# EAGLE design Seri_Board_Led_v1.1 (EAGLE 9.6.2)
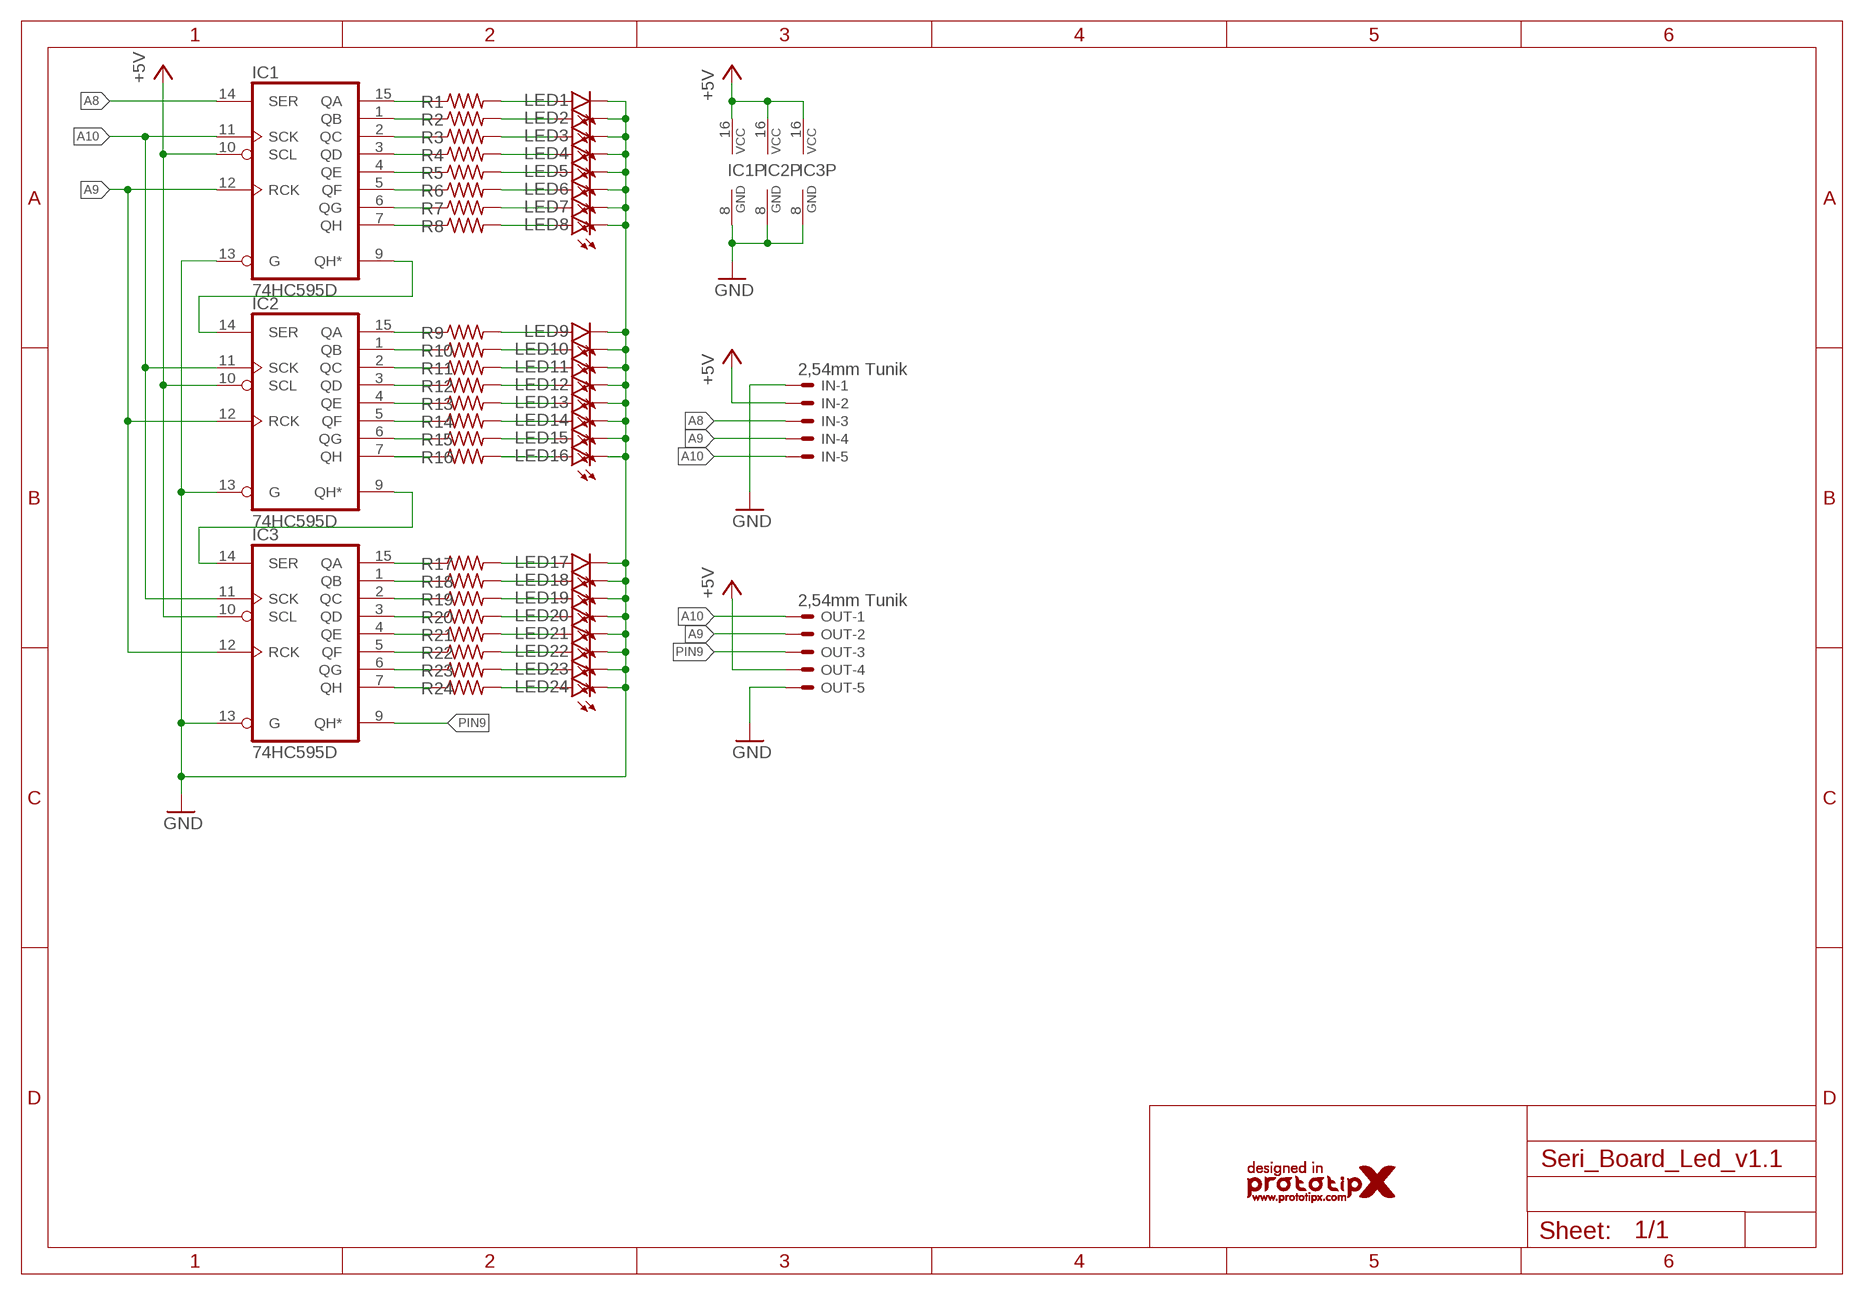
[diagram p0: schematic, sheet 1]

## Parts
IC1  74HC595D  [SO16]
IC2  74HC595D  [SO16]
IC3  74HC595D  [SO16]
IN  2,54mm Tunik  C-GRID-05-70543  [70543-05]
LED1  RED  LED3MM  [LED3MM]
LED2  RED  LED3MM  [LED3MM]
LED3  RED  LED3MM  [LED3MM]
LED4  RED  LED3MM  [LED3MM]
LED5  RED  LED3MM  [LED3MM]
LED6  RED  LED3MM  [LED3MM]
LED7  RED  LED3MM  [LED3MM]
LED8  RED  LED3MM  [LED3MM]
LED9  RED  LED3MM  [LED3MM]
LED10  RED  LED3MM  [LED3MM]
LED11  RED  LED3MM  [LED3MM]
LED12  RED  LED3MM  [LED3MM]
LED13  RED  LED3MM  [LED3MM]
LED14  RED  LED3MM  [LED3MM]
LED15  RED  LED3MM  [LED3MM]
LED16  RED  LED3MM  [LED3MM]
LED17  RED  LED3MM  [LED3MM]
LED18  RED  LED3MM  [LED3MM]
LED19  RED  LED3MM  [LED3MM]
LED20  RED  LED3MM  [LED3MM]
LED21  RED  LED3MM  [LED3MM]
LED22  RED  LED3MM  [LED3MM]
LED23  RED  LED3MM  [LED3MM]
LED24  RED  LED3MM  [LED3MM]
LOGO1  PROTOTIPXDESIGN2  [PROTOTIPX_DESING_15MM]
OUT  2,54mm Tunik  C-GRID-05-70543  [70543-05]
R1  220R  R-US_R0805  [R0805]
R2  220R  R-US_R0805  [R0805]
R3  220R  R-US_R0805  [R0805]
R4  220R  R-US_R0805  [R0805]
R5  220R  R-US_R0805  [R0805]
R6  220R  R-US_R0805  [R0805]
R7  220R  R-US_R0805  [R0805]
R8  220R  R-US_R0805  [R0805]
R9  220R  R-US_R0805  [R0805]
R10  220R  R-US_R0805  [R0805]
R11  220R  R-US_R0805  [R0805]
R12  220R  R-US_R0805  [R0805]
R13  220R  R-US_R0805  [R0805]
R14  220R  R-US_R0805  [R0805]
R15  220R  R-US_R0805  [R0805]
R16  220R  R-US_R0805  [R0805]
R17  220R  R-US_R0805  [R0805]
R18  220R  R-US_R0805  [R0805]
R19  220R  R-US_R0805  [R0805]
R20  220R  R-US_R0805  [R0805]
R21  220R  R-US_R0805  [R0805]
R22  220R  R-US_R0805  [R0805]
R23  220R  R-US_R0805  [R0805]
R24  220R  R-US_R0805  [R0805]

## Nets
+5V: IC1.10(SCL) IC1.16(VCC) IC2.10(SCL) IC2.16(VCC) IC3.10(SCL) IC3.16(VCC) IN.2 OUT.4
A8: IC1.14(SER) IN.3
A9: IC1.12(RCK) IC2.12(RCK) IC3.12(RCK) IN.4 OUT.2
A10: IC1.11(SCK) IC2.11(SCK) IC3.11(SCK) IN.5 OUT.1
GND: IC1.8(GND) IC1.13(G) IC2.8(GND) IC2.13(G) IC3.8(GND) IC3.13(G) IN.1 LED1.K(C) LED2.K(C) LED3.K(C) LED4.K(C) LED5.K(C) LED6.K(C) LED7.K(C) LED8.K(C) LED9.K(C) LED10.K(C) LED11.K(C) LED12.K(C) LED13.K(C) LED14.K(C) LED15.K(C) LED16.K(C) LED17.K(C) LED18.K(C) LED19.K(C) LED20.K(C) LED21.K(C) LED22.K(C) LED23.K(C) LED24.K(C) OUT.5
N$1: LED1.A R1.2
N$2: IC1.15(QA) R1.1
N$3: IC1.1(QB) R2.1
N$4: LED2.A R2.2
N$5: IC1.2(QC) R3.1
N$6: LED3.A R3.2
N$7: IC1.3(QD) R4.1
N$8: LED4.A R4.2
N$9: IC1.4(QE) R5.1
N$10: LED5.A R5.2
N$11: IC1.5(QF) R6.1
N$12: LED6.A R6.2
N$13: IC1.6(QG) R7.1
N$14: LED7.A R7.2
N$15: IC1.7(QH) R8.1
N$16: LED8.A R8.2
N$17: IC2.15(QA) R9.1
N$18: LED9.A R9.2
N$19: IC2.1(QB) R10.1
N$20: LED10.A R10.2
N$21: IC2.2(QC) R11.1
N$22: LED11.A R11.2
N$23: IC2.3(QD) R12.1
N$24: LED12.A R12.2
N$25: IC2.4(QE) R13.1
N$26: LED13.A R13.2
N$27: IC2.5(QF) R14.1
N$28: LED14.A R14.2
N$29: IC2.6(QG) R15.1
N$30: LED15.A R15.2
N$31: IC2.7(QH) R16.1
N$32: LED16.A R16.2
N$33: IC3.15(QA) R17.1
N$34: LED17.A R17.2
N$35: IC3.1(QB) R18.1
N$36: LED18.A R18.2
N$37: IC3.2(QC) R19.1
N$38: LED19.A R19.2
N$39: IC3.3(QD) R20.1
N$40: LED20.A R20.2
N$41: IC3.4(QE) R21.1
N$42: LED21.A R21.2
N$43: IC3.5(QF) R22.1
N$44: LED22.A R22.2
N$45: IC3.6(QG) R23.1
N$46: LED23.A R23.2
N$47: IC3.7(QH) R24.1
N$48: LED24.A R24.2
N$289: IC1.9(QH*) IC2.14(SER)
N$290: IC2.9(QH*) IC3.14(SER)
PIN9: IC3.9(QH*) OUT.3

## Library data of the parts
IC1-IC3 = 74xx-eu:74*595: 8-bit SHIFT REGISTER, output latch
IN OUT = con-molex:C-GRID-05: CONNECTOR wire to board 2.54 mm (0.100") pitch header; MF: MOLEX; OC_FARNELL: unknown; OC_NEWARK: unknown
LED1-LED24 = led:LED: LED OSRAM: - CHIPLED LG R971, LG N971, LY N971, LG Q971, LY Q971, LO R971, LY R971 LH N974, LH R974 LS Q976, LO Q976, LY Q976 LO Q996 - Hyper CHIPLED LW Q18S LB Q993, LB Q99A, LB R99A - SideLED LS A670, LO A670, LY A670, LG A670, LP A670 LB A673, LV A673, LT A673, LW A673 LH A674 LY A675 LS A676, LA A676, LO A676, LY A676, LW A676 LS A679, LY A679, LG A679 - Hyper Micro SIDELED® LS Y876, LA Y876, LO Y876, LY Y876 LT Y87S - SmartLED LW L88C, LW L88S LB L89C, LB L89S, LG L890 LS L89K, LO L89K, LY L89K LS L896, LA L896, LO L896, LY L896 - TOPLED LS T670, LO T670, LY T670, LG T670, LP T670 LSG T670, LSP T670, LSY T670, LOP T670, LYG T670 LG T671, LOG T671, LSG T671 LB T673, LV T673, LT T673, LW T673 LH T674 LS T676, LA T676, LO T676, LY T676, LB T676, LH T676, LSB T676, LW T676 LB T67C, LV T67C, LT T67C, LS T67K, LO T67K, LY T67K, LW E67C LS E67B, LA E67B, LO E67B, LY E67B, LB E67C, LV E67C, LT E67C LW T67C LS T679, LY T679, LG T679 LS T770, LO T770, LY T770, LG T770, LP T770 LB T773, LV T773, LT T773, LW T773 LH T774 LS E675, LA E675, LY E675, LS T675 LS T776, LA T776, LO T776, LY T776, LB T776 LHGB T686 LT T68C, LB T68C - Hyper Mini TOPLED® LB M676 - Mini TOPLED Santana® LG M470 LS M47K, LO M47K, LY M47K Source: http://www.osram.convergy.de LUXEON: - LUMILED® LXK2-PW12-R00, LXK2-PW12-S00, LXK2-PW14-U00, LXK2-PW14-V00 LXK2-PM12-R00, LXK2-PM12-S00, LXK2-PM14-U00 LXK2-PE12-Q00, LXK2-PE12-R00, LXK2-PE12-S00, LXK2-PE14-T00, LXK2-PE14-U00 LXK2-PB12-K00, LXK2-PB12-L00, LXK2-PB12-M00, LXK2-PB14-N00, LXK2-PB14-P00, LXK2-PB14-Q00 LXK2-PR12-L00, LXK2-PR12-M00, LXK2-PR14-Q00, LXK2-PR14-R00 LXK2-PD12-Q00, LXK2-PD12-R00, LXK2-PD12-S00 LXK2-PH12-R00, LXK2-PH12-S00 LXK2-PL12-P00, LXK2-PL12-Q00, LXK2-PL12-R00 Source: www.luxeon.com KINGBRIGHT: KA-3528ASYC Source: www.kingbright.com
LOGO1 = 1-my-library:PROTOTIPX
R1-R24 = rcl:R-US_: RESISTOR, American symbol; SPICEPREFIX: R

## Board
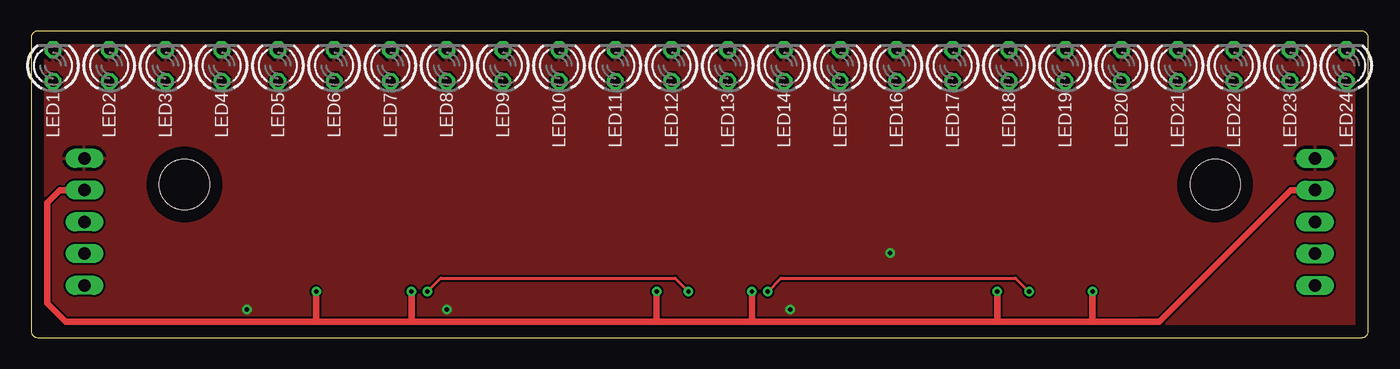
[diagram p1: board, top side]
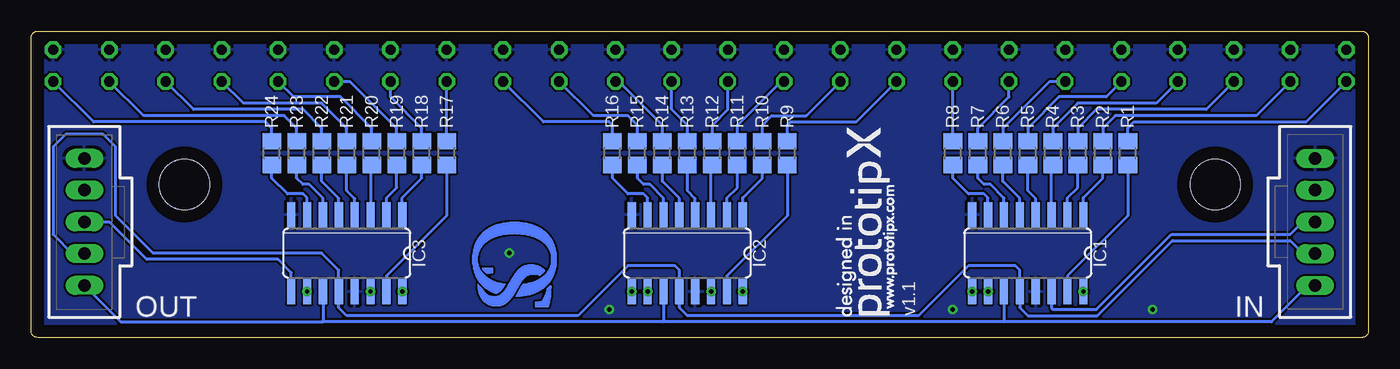
[diagram p2: board, bottom side, seen from below]

Size 107 x 24.5 mm. Coordinates in mm from the lower left corner, seen from the top.
Outline: 0,24 0,0.5 arc90 0.5,0 106.5,0 arc90 107,0.5 107,24 arc90 106.5,24.5 0.5,24.5 arc90 0,24
Copper layers (1*16): Top 0.035mm / dielectric 1.5mm / Bottom 0.035mm
Design rules "default": minimum track width 6mil, minimum drill 0.35mm, track to track 6mil, track to pad 6mil, pad to pad 6mil, via to via 6mil, smd to smd 6mil, copper to edge 40mil, drill to drill 6mil, minimum pad ring 10mil, minimum via ring 8mil, stop-mask expansion 4mil, vias tented up to drill 0mil, thermal gap 10mil
Holes 4 mm at 12.25,12.25 94.75,12.25

### Footprints (pad centres in the part's own frame; a part is rotated, then mirrored left to right if it is on the bottom)
SO16 = smd 0.66 x 2.032: 1 -4.445,-3.073; 2 -3.175,-3.073; 3 -1.905,-3.073; 4 -0.635,-3.073; 5 0.635,-3.073; 6 1.905,-3.073; 7 3.175,-3.073; 8 4.445,-3.073; 9 4.445,3.073; 10 3.175,3.073; 11 1.905,3.073; 12 0.635,3.073; 13 -0.635,3.073; 14 -1.905,3.073; 15 -3.175,3.073; 16 -4.445,3.073
70543-05 = drill 1.016 long: 1 -5.08,0; 2 -2.54,0; 3 0,0; 4 2.54,0; 5 5.08,0
LED3MM = drill 0.813 octagon: A -1.27,0; K 1.27,0
R0805 = smd 1.3 x 1.5: 1 -0.95,0; 2 0.95,0

### Placement (x,y rotation side)
IC1  27.25,6.75 180 bottom
IC2  54.5,6.75 180 bottom
IC3  81.75,6.75 180 bottom
IN  4.25,9.25 270 bottom
LED1  1.75,21.75 90 top
LED2  6.25,21.75 90 top
LED3  10.75,21.75 90 top
LED4  15.25,21.75 90 top
LED5  19.75,21.75 90 top
LED6  24.25,21.75 90 top
LED7  28.75,21.75 90 top
LED8  33.25,21.75 90 top
LED9  37.75,21.75 90 top
LED10  42.25,21.75 90 top
LED11  46.75,21.75 90 top
LED12  51.25,21.75 90 top
LED13  55.75,21.75 90 top
LED14  60.25,21.75 90 top
LED15  64.75,21.75 90 top
LED16  69.25,21.75 90 top
LED17  73.75,21.75 90 top
LED18  78.25,21.75 90 top
LED19  82.75,21.75 90 top
LED20  87.25,21.75 90 top
LED21  91.75,21.75 90 top
LED22  96.25,21.75 90 top
LED23  100.75,21.75 90 top
LED24  105.25,21.75 90 top
LOGO1  38.25,1.75 90 bottom
OUT  102.75,9.25 90 bottom
R1  19.25,14.75 90 bottom
R2  21.25,14.75 90 bottom
R3  23.25,14.75 90 bottom
R4  25.25,14.75 90 bottom
R5  27.25,14.75 90 bottom
R6  29.25,14.75 90 bottom
R7  31.25,14.75 90 bottom
R8  33.25,14.75 90 bottom
R9  46.5,14.75 90 bottom
R10  48.5,14.75 90 bottom
R11  50.5,14.75 90 bottom
R12  52.5,14.75 90 bottom
R13  54.5,14.75 90 bottom
R14  56.5,14.75 90 bottom
R15  58.5,14.75 90 bottom
R16  60.5,14.75 90 bottom
R17  73.75,14.75 90 bottom
R18  75.75,14.75 90 bottom
R19  77.75,14.75 90 bottom
R20  79.75,14.75 90 bottom
R21  81.75,14.75 90 bottom
R22  83.75,14.75 90 bottom
R23  85.75,14.75 90 bottom
R24  87.75,14.75 90 bottom

### Tracks (layer width: path | path; a pad name or v marks a point on that pad's centre or on a via)
+5V  (via drill 0.35)
  Top 0.508: 84.85,1.27 77.25,1.27 | 77.25,1.27 57.65,1.27 | 57.65,1.27 50.05,1.27 | 50.05,1.27 30.45,1.27 | 30.45,1.27 22.75,1.27 | IC1.10 30.43,1.29 30.45,1.27 | IC1.16 22.8,1.32 22.75,1.27 | IC2.16 50.05,1.27 | IC2.10 57.67,1.29 57.65,1.27 | IC3.16 77.31,1.32 77.25,1.27 | IC3.10 84.92,1.34 84.85,1.27 | IN.2 2.29,11.79 1.27,10.77 1.27,2.75 2.75,1.27 22.75,1.27 | 84.85,1.27 88.75,1.27 90.27,1.27 100.79,11.79 OUT.4
  other vias: 30.43,3.68 22.8,3.68 50.05,3.68 57.67,3.68 77.31,3.68 84.92,3.68
A8
  Bottom 0.254: IC1.14 25.34,2.35 25.25,2.25 21.75,2.25 15.75,8.25 6.25,8.25 5.25,9.25 IN.3
A9
  Bottom 0.254: IN.4 5.21,6.71 6.25,7.75 15.68,7.75 21.68,1.75 27.25,1.75 27.89,2.38 IC1.12 27.89,5.38 28.25,5.75 32,5.75 36,1.75 54.5,1.75 55.13,2.38 IC2.12 55.13,5.38 55.5,5.75 59.25,5.75 63.25,1.75 81.75,1.75 82.39,2.38 IC3.12 82.39,5.38 83.75,6.75 97.25,6.75 100.25,9.75 100.25,15.25 101.25,16.25 104.25,16.25 105.25,15.25 105.25,8.25 103.71,6.71 OUT.2
A10
  Bottom 0.254: 29.15,1.25 56.45,1.25 | 56.45,1.25 83.65,1.25 | IC3.11 83.66,1.25 83.65,1.25 | IC2.11 56.41,1.29 56.45,1.25 | IC1.11 29.16,1.25 29.15,1.25 | IN.5 4.83,4.17 7.75,1.25 29.15,1.25 | 83.65,1.25 98.25,1.25 99.83,1.25 OUT.1
GND  (via drill 0.35)
  other vias: 60.75,2.25 33.25,2.25 17.25,2.25 68.75,6.75
  pour Bottom: 107.75,-0.75 -0.75,-0.75 -0.75,25.25 107.75,25.25
  pour Top: -1.25,25.75 -1.25,-1.25 108.25,-1.25 108.25,25.75
N$1
  Bottom 0.254: R1.2 19.25,16.75 18.75,17.25 4.98,17.25 LED1.A
N$2
  Bottom 0.254: IC1.15 24.07,4.92 19.25,9.75 R1.1
N$3
  Bottom 0.254: IC1.1 22.8,11.2 21.25,12.75 R2.1
N$4
  Bottom 0.254: LED2.A 8.98,17.75 20.25,17.75 21.25,16.75 R2.2
N$5
  Bottom 0.254: IC1.2 24.07,11.18 23.25,12 R3.1
N$6
  Bottom 0.254: LED3.A 12.98,18.25 21.75,18.25 23.25,16.75 R3.2
N$7
  Bottom 0.254: IC1.3 25.34,13.71 R4.1
N$8
  Bottom 0.254: LED4.A 16.98,18.75 23.25,18.75 25.25,16.75 R4.2
N$9
  Bottom 0.254: IC1.4 26.61,11.12 27.25,11.75 R5.1
N$10
  Bottom 0.254: LED5.A 20.98,19.25 24.75,19.25 27.25,16.75 R5.2
N$11
  Bottom 0.254: IC1.5 27.89,11.13 29.25,12.5 R6.1
N$12
  Bottom 0.254: LED6.A 25.52,20.48 29.25,16.75 R6.2
N$13
  Bottom 0.254: IC1.6 29.16,11.15 30.25,12.25 30.75,12.25 31.25,12.75 R7.1
N$14
  Bottom 0.254: R7.2 31.25,16.75 28.75,19.25 LED7.A
N$15
  Bottom 0.254: IC1.7 30.43,11.18 30.75,11.5 32,11.5 33.25,12.75 R8.1
N$16
  Bottom 0.254: R8.2 LED8.A
N$17
  Bottom 0.254: R9.1 46.5,9.75 51.33,4.92 IC2.15
N$18
  Bottom 0.254: R9.2 46.5,17 46.25,17.25 40.98,17.25 LED9.A
N$19
  Bottom 0.254: IC2.1 50.05,11.2 48.5,12.75 R10.1
N$20
  Bottom 0.254: R10.2 48.5,17 47.75,17.75 44.98,17.75 LED10.A
N$21
  Bottom 0.254: IC2.2 51.33,11.18 50.5,12 R11.1
N$22
  Bottom 0.254: R11.2 50.5,17 47.02,20.48 LED11.A
N$23
  Bottom 0.254: IC2.3 52.59,13.71 R12.1
N$24
  Bottom 0.254: R12.2 52.5,17 51.25,18.25 LED12.A
N$25
  Bottom 0.254: IC2.4 53.87,11.12 54.5,11.75 R13.1
N$26
  Bottom 0.254: R13.2 54.5,17 55.75,18.25 LED13.A
N$27
  Bottom 0.254: IC2.5 55.13,11.13 56.5,12.5 R14.1
N$28
  Bottom 0.254: R14.2 56.5,17 59.98,20.48 LED14.A
N$29
  Bottom 0.254: IC2.6 56.41,11.15 57.5,12.25 58,12.25 58.5,12.75 R15.1
N$30
  Bottom 0.254: R15.2 58.5,17 59.25,17.75 62.02,17.75 LED15.A
N$31
  Bottom 0.254: IC2.7 57.67,11.18 58,11.5 59.25,11.5 60.5,12.75 R16.1
N$32
  Bottom 0.254: R16.2 60.5,17 60.75,17.25 66.02,17.25 LED16.A
N$33
  Bottom 0.254: R17.1 73.75,9.75 78.58,4.92 IC3.15
N$34
  Bottom 0.254: R17.2 LED17.A
N$35
  Bottom 0.254: IC3.1 77.31,11.2 75.75,12.75 R18.1
N$36
  Bottom 0.254: R18.2 75.75,16.75 78.25,19.25 LED18.A
N$37
  Bottom 0.254: IC3.2 78.58,11.18 77.75,12 R19.1
N$38
  Bottom 0.254: R19.2 77.75,16.75 81.48,20.48 LED19.A
N$39
  Bottom 0.254: IC3.3 79.84,13.71 R20.1
N$40
  Bottom 0.254: R20.2 79.75,16.75 82.25,19.25 86.02,19.25 LED20.A
N$41
  Bottom 0.254: IC3.4 81.11,11.12 81.75,11.75 R21.1
N$42
  Bottom 0.254: R21.2 81.75,16.75 83.75,18.75 90.02,18.75 LED21.A
N$43
  Bottom 0.254: IC3.5 82.39,11.13 83.75,12.5 R22.1
N$44
  Bottom 0.254: R22.2 83.75,16.75 85.25,18.25 94.02,18.25 LED22.A
N$45
  Bottom 0.254: IC3.6 83.66,11.15 84.75,12.25 85.25,12.25 85.75,12.75 R23.1
N$46
  Bottom 0.254: R23.2 85.75,16.75 86.75,17.75 98.02,17.75 LED23.A
N$47
  Bottom 0.254: IC3.7 84.92,11.18 85.25,11.5 86.5,11.5 87.75,12.75 R24.1
N$48
  Bottom 0.254: R24.2 87.75,16.75 88.25,17.25 102.02,17.25 LED24.A
N$289  (via drill 0.35)
  Top 0.254: IC1.9 32.77,4.75 51.52,4.75 IC2.14
  other vias: 31.7,3.68 52.59,3.68
N$290  (via drill 0.35)
  Top 0.254: IC2.9 60.02,4.75 78.77,4.75 IC3.14
  other vias: 58.95,3.68 79.84,3.68
PIN9
  Bottom 0.254: IC3.9 86.19,5.2 87.25,6.25 97.75,6.25 100.75,9.25 OUT.3
(copper drawn outside any net)
  shapes: Bottom area x747

### Text on the board
bNames: v1.1